# Altium schematic sheet CPU2.schdoc
size C; SheetNumber: 2; SheetTotal: 8
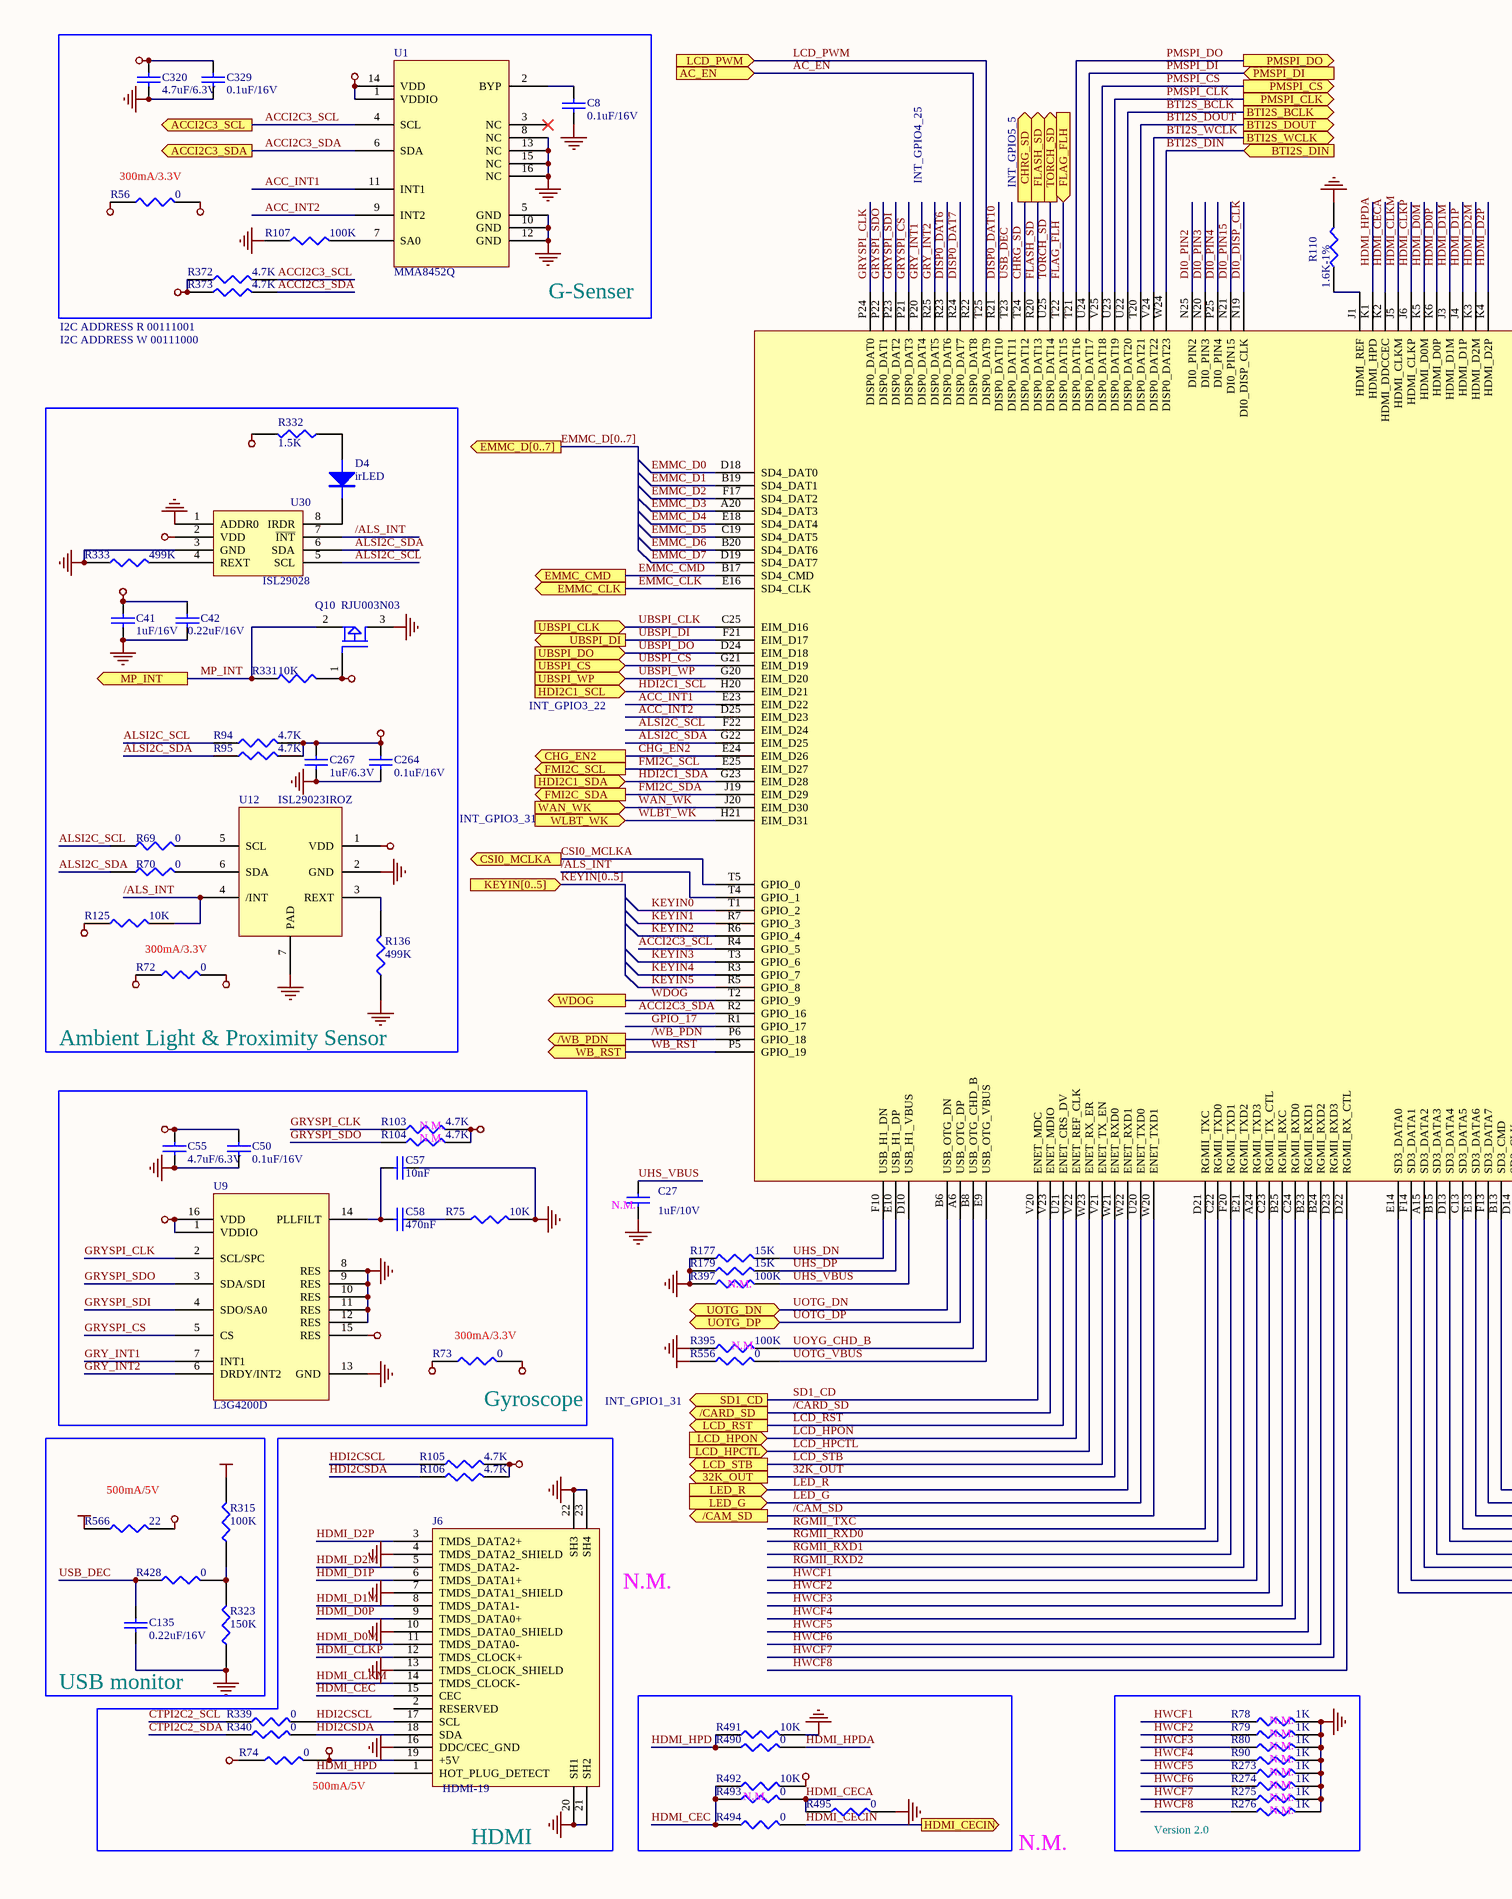
[diagram p0: CPU2.schdoc, left]
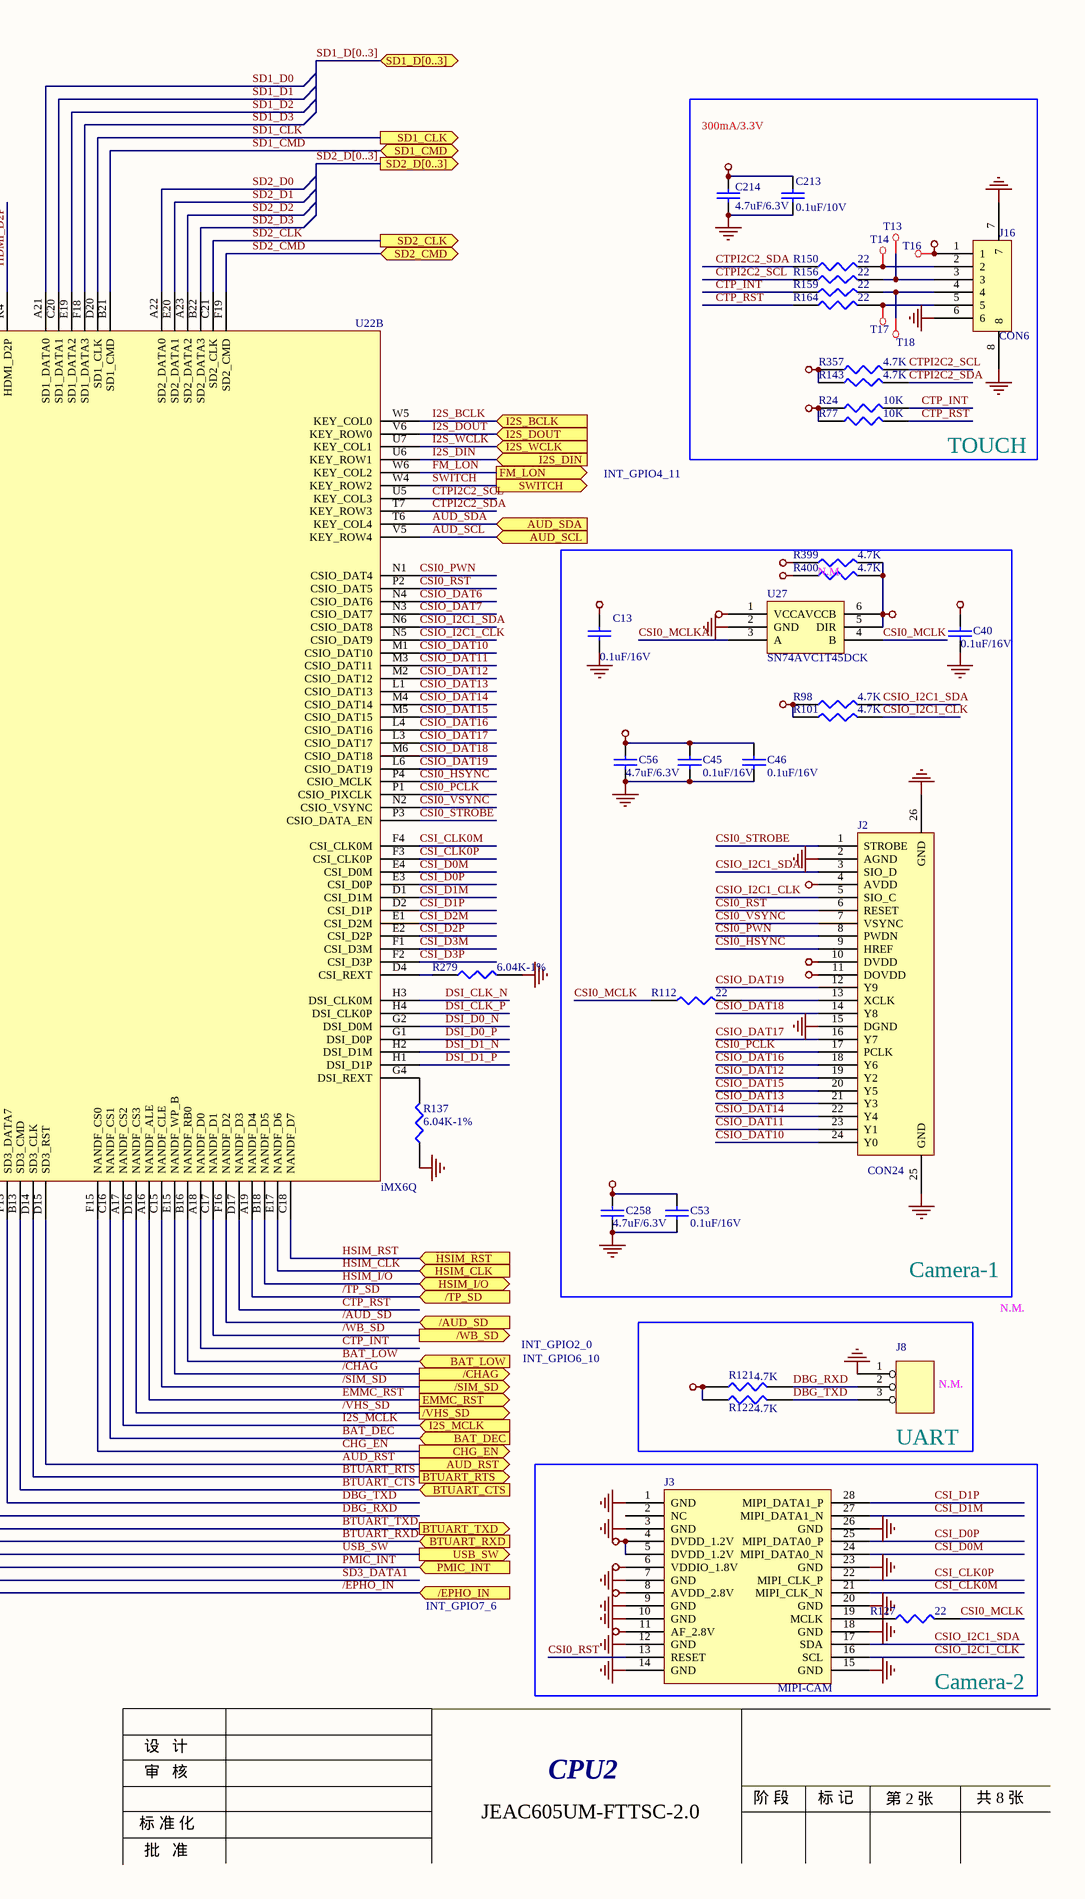
[diagram p1: CPU2.schdoc, right]

## Parts
C8  0.1uF/16V  [C0402]
C13  0.1uF/16V  [C0402]
C27  1uF/10V  [C0603]
C40  0.1uF/16V  [C0402]
C41  1uF/16V  [C0402]
C42  0.22uF/16V  [C0402]
C45  0.1uF/16V  [C0402]
C46  0.1uF/16V  [C0402]
C50  0.1uF/16V  [C0402]
C53  0.1uF/16V  [C0402]
C55  4.7uF/6.3V  [C0603]
C56  4.7uF/6.3V  [C0603]
C57  10nF  [C0402]
C58  470nF  [C0402]
C135  0.22uF/16V  [C0402]
C213  0.1uF/10V  [C0402]
C214  4.7uF/6.3V  [C0603]
C258  4.7uF/6.3V  [C0603]
C264  0.1uF/16V  [C0402]
C267  1uF/6.3V  [C0402]
C320  4.7uF/6.3V  [C0603]
C329  0.1uF/16V  [C0402]
D4  irLED  [R0603]
J2  CON24  [J-CON-24-0_5]
J3  MIPI-CAM  [j-con-GB042-28P-H10-0_4]
J6  HDMI-19  [j-con-19-0_4]
J8  (no value)  [J-CON-3-2_1]
J16  CON6  [J-CON-6-0_5-ATOM]
Q10  RJU003N03  [SOT-23]
R24  10K  [R0402]
R56  0  [R0402]
R69  0  [R0402]
R70  0  [R0402]
R72  0  [R0402]
R73  0  [R0402]
R74  0  [R0603]
R75  10K  [R0402]
R77  10K  [R0402]
R78  1K  [R0402]
R79  1K  [R0402]
R80  1K  [R0402]
R90  1K  [R0402]
R94  4.7K  [R0402]
R95  4.7K  [R0402]
R98  4.7K  [R0402]
R101  4.7K  [R0402]
R103  4.7K  [R0402]
R104  4.7K  [R0402]
R105  4.7K  [R0402]
R106  4.7K  [R0402]
R107  100K  [R0402]
R110  1.6K-1%  [R0402]
R112  22  [R0402]
R121  4.7K  [R0402]
R122  4.7K  [R0402]
R125  10K  [R0402]
R127  22  [R0402]
R136  499K  [R0402]
R137  6.04K-1%  [R0402]
R143  4.7K  [R0402]
R150  22  [R0402]
R156  22  [R0402]
R159  22  [R0402]
R164  22  [R0402]
R177  15K  [R0402]
R179  15K  [R0402]
R273  1K  [R0402]
R274  1K  [R0402]
R275  1K  [R0402]
R276  1K  [R0402]
R279  6.04K-1%  [R0402]
R315  100K  [R0402]
R323  150K  [R0402]
R331  10K  [R0402]
R332  1.5K  [R0402]
R333  499K  [R0402]
R339  0  [R0402]
R340  0  [R0402]
R357  4.7K  [R0402]
R372  4.7K  [R0402]
R373  4.7K  [R0402]
R395  100K  [R0402]
R397  100K  [R0402]
R399  4.7K  [R0402]
R400  4.7K  [R0402]
R428  0  [R0402]
R490  0  [R0402]
R491  10K  [R0402]
R492  10K  [R0402]
R493  0  [R0402]
R494  0  [R0402]
R495  0  [R0402]
R556  0  [R0402]
R566  22  [R0402]
T13  Testpoint  [TP2_0]  (value not drawn)
T14  Testpoint  [TP2_0]  (value not drawn)
T16  Testpoint  [TP2_0]  (value not drawn)
T17  Testpoint  [TP2_0]  (value not drawn)
T18  Testpoint  [TP2_0]  (value not drawn)
U1  MMA8452Q  [U-DFN-16-0_5]
U9  L3G4200D  [U-LGA-16-0_65]
U12  ISL29023IROZ  [U-ODFN-6-0_65]
U22  iMX6Q  [U-BGA-624-0_8]  (part B of 3)
U27  SN74AVC1T45DCK  [SOT-363-6-0_65]
U30  ISL29028  [U-ODFN-8-0_5]

## Blocks framed on the sheet
G-Senser: C8 C320 C329 R56 R107 R372 R373 U1
TOUCH: C213 C214 J16 R24 R77 R143 R150 R156 R159 R164 R357 T13 T14 T16-T18
Ambient Light & Proximity Sensor: C41 C42 C264 C267 D4 Q10 R69 R70 R72 R94 R95 R125 R136 R331-R333 U12 U30
Camera-1: C13 C40 C45 C46 C53 C56 C258 J2 R98 R101 R112 R399 R400 U27
Gyroscope: C50 C55 C57 C58 R73 R75 R103 R104 U9
UART: J8 R121 R122
USB monitor: C135 R315 R323 R428 R566
HDMI: J6 R74 R105 R106 R339 R340
Camera-2: J3 R127
N.M.: R490-R495

## Ports
32K_OUT (out), /AUD_SD (in), /CAM_SD (out), /CARD_SD (out), /CHAG (out), /EPHO_IN (in), /SIM_SD (out), /TP_SD (in), /VHS_SD (out), /WB_PDN (out), /WB_SD (out), AC_EN (in), ACCI2C3_SCL (out), ACCI2C3_SDA (out), AUD_RST (out), AUD_SCL (in), AUD_SDA (in), BAT_DEC (in), BAT_LOW (in), BTI2S_BCLK (out), BTI2S_DIN (in), BTI2S_DOUT (out), BTI2S_WCLK (out), BTUART_CTS (in), BTUART_RTS (out), BTUART_RXD (in), BTUART_TXD (out), CHG_EN2 (out), CHG_EN (out), CHRG_SD (out), CSI0_MCLKA (out), EMMC_CLK (out), EMMC_CMD (out), EMMC_D[0..7] (out), EMMC_RST (out), FLAG_FLH (in), FLASH_SD (out), FM_LON (out), FMI2C_SCL (out), FMI2C_SDA (out), HDI2C1_SCL (in), HDI2C1_SDA (in), HDMI_CECIN (out), HSIM_CLK (in), HSIM_I/O (bidir), HSIM_RST (in), I2S_BCLK (in), I2S_DIN (in), I2S_DOUT (in), I2S_MCLK (in), I2S_WCLK (in), KEYIN[0..5] (in), LCD_HPCTL (in), LCD_HPON (in), LCD_PWM (in), LCD_RST (out), LCD_STB (out), LED_G (in), LED_R (in), MP_INT (out), PMIC_INT (in), PMSPI_CLK (out), PMSPI_CS (out), PMSPI_DI (in), PMSPI_DO (out), SD1_CD (out), SD1_CLK (out), SD1_CMD (bidir), SD1_D[0..3] (bidir), SD2_CLK (out), SD2_CMD (bidir), SD2_D[0..3] (out), SWITCH (out), TORCH_SD (out), UBSPI_CLK (in), UBSPI_CS (in), UBSPI_DI (out), UBSPI_DO (in), UBSPI_WP (in), UOTG_DN (bidir), UOTG_DP (bidir), USB_SW (out), WAN_WK (in), WB_RST (out), WDOG (out), WLBT_WK (in)

## Nets
GND: C8.1 C13.2 C27.2 C40.2 C41.2 C42.2 C45.2 C46.2 C50.1 C53.2 C55.1 C56.1 C57.1 C135.2 C213.2 C214.2 C258.1 C264.1 C267.1 C320.1 C329.1 J2.2(AGND) J2.15(DGND) J2.25(GND) J2.26(GND) J3.1(GND) J3.3(GND) J3.7(GND) J3.9(GND) J3.10(GND) J3.12(GND) J3.14(GND) J3.15(GND) J3.18(GND) J3.20(GND) J3.23(GND) J3.26(GND) J6.4(TMDS_DATA2_SHIELD) J6.7(TMDS_DATA1_SHIELD) J6.10(TMDS_DATA0_SHIELD) J6.13(TMDS_CLOCK_SHIELD) J6.16(DDC/CEC_GND) J6.20(SH1) J6.21(SH2) J6.22(SH3) J6.23(SH4) J8.1 J16.6 J16.7 J16.8 Q10.3(D) R75.2 R78.2 R79.2 R80.2 R90.2 R107.1 R110.2 R136.1 R137.1 R177.1 R179.1 R273.2 R274.2 R275.2 R276.2 R279.2 R323.1 R333.1 R395.1 R397.1 R491.2 R495.2 U1.5(GND) U1.8(NC) U1.10(GND) U1.12(GND) U1.13(NC) U1.15(NC) U1.16(NC) U9.8(RES) U9.9(RES) U9.10(RES) U9.11(RES) U9.12(RES) U9.13(GND) U12.2(GND) U12.7(PAD) U27.2(GND) U30.1(ADDR0) U30.3(GND)
USB_BUSIN: R315.2 R556.1 R566.1
VBUS: R74.1 R566.2
VCC_3V: C13.1 R121.1 R122.1 U27.1(VCCA)
VCC_ACC: C320.2 C329.2 R56.2 R372.1 R373.1 U1.1(VDDIO) U1.14(VDD)
VCC_ALS: C41.1 C42.1 C264.2 C267.2 Q10.1(G) R72.2 R94.2 R95.2 R125.1 R331.2 R332.2 U12.1(VDD) U30.2(VDD)
VCC_CAM: C45.1 C46.1 C56.2 J2.4(AVDD) J2.11(DOVDD) J3.6(VDDIO_1.8V) J3.8(AVDD_2.8V) J3.11(AF_2.8V) R98.1 R101.1
VCC_CAMD: C53.1 C258.2 J2.10(DVDD) J3.4(DVDD_1.2V) J3.5(DVDD_1.2V)
VCC_CSI: R399.1
VCC_GYR: C50.2 C55.2 R73.2 R103.2 R104.2 U9.1(VDDIO) U9.15(RES) U9.16(VDD)
VCC_HD: J6.19(+5V) R74.2 R105.2 R106.2 R492.2
VCC_MCLK: C40.1 R399.2 R400.2 U27.5(DIR) U27.6(VCCB)
VCC_MEMS: R56.1 R72.1 R73.1
VCC_MIPI: R400.1
VCC_TOUCH: C213.1 C214.1 J16.1 R24.1 R77.1 R143.1 R357.1 T16.1(TP)
32K_OUT: U22.W21(ENET_RXD0) ; port 32K_OUT
/ALS_INT: R125.2 U12.4(/INT) U22.T4(GPIO_1) U30.7(~{INT})
/AUD_SD: U22.F16(NANDF_D2) ; port /AUD_SD
/CAM_SD: U22.W20(ENET_TXD1) ; port /CAM_SD
/CARD_SD: U22.V23(ENET_MDIO) ; port /CARD_SD
/CHAG: U22.E15(NANDF_WP_B) ; port /CHAG
/EPHO_IN: U22.E14(SD3_DATA0) ; port /EPHO_IN
/SIM_SD: U22.C15(NANDF_CLE) ; port /SIM_SD
/TP_SD: U22.A19(NANDF_D4) ; port /TP_SD
/VHS_SD: U22.D16(NANDF_CS3) ; port /VHS_SD
/WB_PDN: U22.P6(GPIO_18) ; port /WB_PDN
/WB_SD: U22.C17(NANDF_D1) ; port /WB_SD
AC_EN: U22.R22(DISP0_DAT8) ; port AC_EN
ACC_INT1: U1.11(INT1) U22.E23(EIM_D22)
ACC_INT2: U1.9(INT2) U22.D25(EIM_D23)
ACCI2C3_SCL: R372.2 U1.4(SCL) U22.R4(GPIO_5) ; port ACCI2C3_SCL
ACCI2C3_SDA: R373.2 U1.6(SDA) U22.R2(GPIO_16) ; port ACCI2C3_SDA
ALSI2C_SCL: R69.1 R94.1 U22.F22(EIM_D24) U30.5(SCL)
ALSI2C_SDA: R70.1 R95.1 U22.G22(EIM_D25) U30.6(SDA)
AUD_RST: U22.D15(SD3_RST) ; port AUD_RST
AUD_SCL: U22.V5(KEY_ROW4) ; port AUD_SCL
AUD_SDA: U22.T6(KEY_COL4) ; port AUD_SDA
BAT_DEC: U22.C16(NANDF_CS1) ; port BAT_DEC
BAT_LOW: U22.B16(NANDF_RB0) ; port BAT_LOW
BTI2S_BCLK: U22.U22(DISP0_DAT20) ; port BTI2S_BCLK
BTI2S_DIN: U22.W24(DISP0_DAT23) ; port BTI2S_DIN
BTI2S_DOUT: U22.T20(DISP0_DAT21) ; port BTI2S_DOUT
BTI2S_WCLK: U22.V24(DISP0_DAT22) ; port BTI2S_WCLK
BTUART_CTS: U22.B13(SD3_CMD) ; port BTUART_CTS
BTUART_RTS: U22.D14(SD3_CLK) ; port BTUART_RTS
BTUART_RXD: U22.D13(SD3_DATA4) ; port BTUART_RXD
BTUART_TXD: U22.C13(SD3_DATA5) ; port BTUART_TXD
CHG_EN: U22.F15(NANDF_CS0) ; port CHG_EN
CHG_EN2: U22.E24(EIM_D26) ; port CHG_EN2
CHRG_SD: U22.T24(DISP0_DAT12) ; port CHRG_SD
CSI0_HSYNC: J2.9(HREF) U22.P4(CSIO_MCLK)
CSI0_MCLK: R112.1 R127.2 U27.4(B)
CSI0_MCLKA: U22.T5(GPIO_0) U27.3(A) ; port CSI0_MCLKA
CSI0_PCLK: J2.17(PCLK) U22.P1(CSIO_PIXCLK)
CSI0_PWN: J2.8(PWDN) U22.N1(CSIO_DAT4)
CSI0_RST: J2.6(RESET) J3.13(RESET) U22.P2(CSIO_DAT5)
CSI0_STROBE: J2.1(STROBE) U22.P3(CSIO_DATA_EN)
CSI0_VSYNC: J2.7(VSYNC) U22.N2(CSIO_VSYNC)
CSI_CLK0M: J3.21(MIPI_CLK_N) U22.F4(CSI_CLK0M)
CSI_CLK0P: J3.22(MIPI_CLK_P) U22.F3(CSI_CLK0P)
CSI_D0M: J3.24(MIPI_DATA0_N) U22.E4(CSI_D0M)
CSI_D0P: J3.25(MIPI_DATA0_P) U22.E3(CSI_D0P)
CSI_D1M: J3.27(MIPI_DATA1_N) U22.D1(CSI_D1M)
CSI_D1P: J3.28(MIPI_DATA1_P) U22.D2(CSI_D1P)
CSI_D2M: U22.E1(CSI_D2M)
CSI_D2P: U22.E2(CSI_D2P)
CSI_D3M: U22.F1(CSI_D3M)
CSI_D3P: U22.F2(CSI_D3P)
CSIO_DAT6: U22.N4(CSIO_DAT6)
CSIO_DAT7: U22.N3(CSIO_DAT7)
CSIO_DAT10: J2.24(Y0) U22.M1(CSIO_DAT10)
CSIO_DAT11: J2.23(Y1) U22.M3(CSIO_DAT11)
CSIO_DAT12: J2.19(Y2) U22.M2(CSIO_DAT12)
CSIO_DAT13: J2.21(Y3) U22.L1(CSIO_DAT13)
CSIO_DAT14: J2.22(Y4) U22.M4(CSIO_DAT14)
CSIO_DAT15: J2.20(Y5) U22.M5(CSIO_DAT15)
CSIO_DAT16: J2.18(Y6) U22.L4(CSIO_DAT16)
CSIO_DAT17: J2.16(Y7) U22.L3(CSIO_DAT17)
CSIO_DAT18: J2.14(Y8) U22.M6(CSIO_DAT18)
CSIO_DAT19: J2.12(Y9) U22.L6(CSIO_DAT19)
CSIO_I2C1_CLK: J2.5(SIO_C) J3.16(SCL) R101.2 U22.N5(CSIO_DAT9)
CSIO_I2C1_SDA: J2.3(SIO_D) J3.17(SDA) R98.2 U22.N6(CSIO_DAT8)
CTP_INT: R24.2 R159.1 U22.A18(NANDF_D0)
CTP_RST: R77.2 R164.1 U22.D17(NANDF_D3)
CTPI2C2_SCL: R156.1 R339.1 R357.2 U22.U5(KEY_COL3)
CTPI2C2_SDA: R143.2 R150.1 R340.1 U22.T7(KEY_ROW3)
DBG_RXD: J8.2 R121.2 U22.E13(SD3_DATA6)
DBG_TXD: J8.3 R122.2 U22.F13(SD3_DATA7)
DI0_DISP_CLK: U22.N19(DI0_DISP_CLK)
DI0_PIN2: U22.N25(DI0_PIN2)
DI0_PIN3: U22.N20(DI0_PIN3)
DI0_PIN4: U22.P25(DI0_PIN4)
DI0_PIN15: U22.N21(DI0_PIN15)
DISP0_DAT6: U22.R23(DISP0_DAT6)
DISP0_DAT7: U22.R24(DISP0_DAT7)
DISP0_DAT10: U22.R21(DISP0_DAT10)
DSI_CLK_N: U22.H3(DSI_CLK0M)
DSI_CLK_P: U22.H4(DSI_CLK0P)
DSI_D0_N: U22.G2(DSI_D0M)
DSI_D0_P: U22.G1(DSI_D0P)
DSI_D1_N: U22.H2(DSI_D1M)
DSI_D1_P: U22.H1(DSI_D1P)
EMMC_CLK: U22.E16(SD4_CLK) ; port EMMC_CLK
EMMC_CMD: U22.B17(SD4_CMD) ; port EMMC_CMD
EMMC_D0: U22.D18(SD4_DAT0)
EMMC_D1: U22.B19(SD4_DAT1)
EMMC_D2: U22.F17(SD4_DAT2)
EMMC_D3: U22.A20(SD4_DAT3)
EMMC_D4: U22.E18(SD4_DAT4)
EMMC_D5: U22.C19(SD4_DAT5)
EMMC_D6: U22.B20(SD4_DAT6)
EMMC_D7: U22.D19(SD4_DAT7)
EMMC_RST: U22.A16(NANDF_ALE) ; port EMMC_RST
FLAG_FLH: U22.T22(DISP0_DAT15) ; port FLAG_FLH
FLASH_SD: U22.R20(DISP0_DAT13) ; port FLASH_SD
FM_LON: U22.W6(KEY_COL2) ; port FM_LON
FMI2C_SCL: U22.E25(EIM_D27) ; port FMI2C_SCL
FMI2C_SDA: U22.J19(EIM_D29) ; port FMI2C_SDA
GPIO_17: U22.R1(GPIO_17)
GRY_INT1: U9.7(INT1) U22.P20(DISP0_DAT4)
GRY_INT2: U9.6(DRDY/INT2) U22.R25(DISP0_DAT5)
GRYSPI_CLK: R103.1 U9.2(SCL/SPC) U22.P24(DISP0_DAT0)
GRYSPI_CS: U9.5(CS) U22.P21(DISP0_DAT3)
GRYSPI_SDI: U9.4(SDO/SA0) U22.P23(DISP0_DAT2)
GRYSPI_SDO: R104.1 U9.3(SDA/SDI) U22.P22(DISP0_DAT1)
HDI2C1_SCL: U22.H20(EIM_D21) ; port HDI2C1_SCL
HDI2C1_SDA: U22.G23(EIM_D28) ; port HDI2C1_SDA
HDI2CSCL: J6.17(SCL) R105.1 R339.2
HDI2CSDA: J6.18(SDA) R106.1 R340.2
HDMI_CEC: J6.15(CEC) R492.1 R493.1 R494.1
HDMI_CECA: R493.2 R495.1 U22.K2(HDMI_DDCCEC)
HDMI_CECIN: R494.2 ; port HDMI_CECIN
HDMI_CLKM: J6.14(TMDS_CLOCK-) U22.J5(HDMI_CLKM)
HDMI_CLKP: J6.12(TMDS_CLOCK+) U22.J6(HDMI_CLKP)
HDMI_D0M: J6.11(TMDS_DATA0-) U22.K5(HDMI_D0M)
HDMI_D0P: J6.9(TMDS_DATA0+) U22.K6(HDMI_D0P)
HDMI_D1M: J6.8(TMDS_DATA1-) U22.J3(HDMI_D1M)
HDMI_D1P: J6.6(TMDS_DATA1+) U22.J4(HDMI_D1P)
HDMI_D2M: J6.5(TMDS_DATA2-) U22.K3(HDMI_D2M)
HDMI_D2P: J6.3(TMDS_DATA2+) U22.K4(HDMI_D2P)
HDMI_HPD: J6.1(HOT_PLUG_DETECT) R490.1 R491.1
HDMI_HPDA: R490.2 U22.K1(HDMI_HPD)
HSIM_CLK: U22.E17(NANDF_D6) ; port HSIM_CLK
HSIM_I/O: U22.B18(NANDF_D5) ; port HSIM_I/O
HSIM_RST: U22.C18(NANDF_D7) ; port HSIM_RST
HWCF1: R78.1 U22.A24(RGMII_TXD3)
HWCF2: R79.1 U22.C23(RGMII_TX_CTL)
HWCF3: R80.1 U22.B25(RGMII_RXC)
HWCF4: R90.1 U22.C24(RGMII_RXD0)
HWCF5: R273.1 U22.B23(RGMII_RXD1)
HWCF6: R274.1 U22.B24(RGMII_RXD2)
HWCF7: R275.1 U22.D23(RGMII_RXD3)
HWCF8: R276.1 U22.D22(RGMII_RX_CTL)
I2S_BCLK: U22.W5(KEY_COL0) ; port I2S_BCLK
I2S_DIN: U22.U6(KEY_ROW1) ; port I2S_DIN
I2S_DOUT: U22.V6(KEY_ROW0) ; port I2S_DOUT
I2S_MCLK: U22.A17(NANDF_CS2) ; port I2S_MCLK
I2S_WCLK: U22.U7(KEY_COL1) ; port I2S_WCLK
KEYIN0: U22.T1(GPIO_2)
KEYIN1: U22.R7(GPIO_3)
KEYIN2: U22.R6(GPIO_4)
KEYIN3: U22.T3(GPIO_6)
KEYIN4: U22.R3(GPIO_7)
KEYIN5: U22.R5(GPIO_8)
LCD_HPCTL: U22.W23(ENET_RX_ER) ; port LCD_HPCTL
LCD_HPON: U22.V22(ENET_REF_CLK) ; port LCD_HPON
LCD_PWM: U22.T25(DISP0_DAT9) ; port LCD_PWM
LCD_RST: U22.U21(ENET_CRS_DV) ; port LCD_RST
LCD_STB: U22.V21(ENET_TX_EN) ; port LCD_STB
LED_G: U22.U20(ENET_TXD0) ; port LED_G
LED_R: U22.W22(ENET_RXD1) ; port LED_R
MP_INT: Q10.2(S) R331.1 ; port MP_INT
PMIC_INT: U22.A15(SD3_DATA2) ; port PMIC_INT
PMSPI_CLK: U22.U23(DISP0_DAT19) ; port PMSPI_CLK
PMSPI_CS: U22.V25(DISP0_DAT18) ; port PMSPI_CS
PMSPI_DI: U22.U24(DISP0_DAT17) ; port PMSPI_DI
PMSPI_DO: U22.T21(DISP0_DAT16) ; port PMSPI_DO
RGMII_RXD0: U22.C22(RGMII_TXD0)
RGMII_RXD1: U22.F20(RGMII_TXD1)
RGMII_RXD2: U22.E21(RGMII_TXD2)
RGMII_TXC: U22.D21(RGMII_TXC)
SD1_CD: U22.V20(ENET_MDC) ; port SD1_CD
SD1_CLK: U22.D20(SD1_CLK) ; port SD1_CLK
SD1_CMD: U22.B21(SD1_CMD) ; port SD1_CMD
SD1_D0: U22.A21(SD1_DATA0)
SD1_D1: U22.C20(SD1_DATA1)
SD1_D2: U22.E19(SD1_DATA2)
SD1_D3: U22.F18(SD1_DATA3)
SD2_CLK: U22.C21(SD2_CLK) ; port SD2_CLK
SD2_CMD: U22.F19(SD2_CMD) ; port SD2_CMD
SD2_D0: U22.A22(SD2_DATA0)
SD2_D1: U22.E20(SD2_DATA1)
SD2_D2: U22.A23(SD2_DATA2)
SD2_D3: U22.B22(SD2_DATA3)
SD3_DATA1: U22.F14(SD3_DATA1)
SWITCH: U22.W4(KEY_ROW2) ; port SWITCH
TORCH_SD: U22.U25(DISP0_DAT14) ; port TORCH_SD
UBSPI_CLK: U22.C25(EIM_D16) ; port UBSPI_CLK
UBSPI_CS: U22.G21(EIM_D19) ; port UBSPI_CS
UBSPI_DI: U22.F21(EIM_D17) ; port UBSPI_DI
UBSPI_DO: U22.D24(EIM_D18) ; port UBSPI_DO
UBSPI_WP: U22.G20(EIM_D20) ; port UBSPI_WP
UHS_DN: R177.2 U22.F10(USB_H1_DN)
UHS_DP: R179.2 U22.E10(USB_H1_DP)
UHS_VBUS: C27.1 R397.2 U22.D10(USB_H1_VBUS)
UOTG_DN: U22.B6(USB_OTG_DN) ; port UOTG_DN
UOTG_DP: U22.A6(USB_OTG_DP) ; port UOTG_DP
UOTG_VBUS: R556.2 U22.E9(USB_OTG_VBUS)
UOYG_CHD_B: R395.2 U22.B8(USB_OTG_CHD_B)
USB_DEC: C135.1 R428.1 U22.T23(DISP0_DAT11)
USB_SW: U22.B15(SD3_DATA3) ; port USB_SW
WAN_WK: U22.J20(EIM_D30) ; port WAN_WK
WB_RST: U22.P5(GPIO_19) ; port WB_RST
WDOG: U22.T2(GPIO_9) ; port WDOG
WLBT_WK: U22.H21(EIM_D31) ; port WLBT_WK
NetC8_2: C8.2 U1.2(BYP)
NetC57_2: C57.2 C58.2 U9.14(PLLFILT)
NetC58_1: C58.1 R75.1
NetD4_1: D4.1 R332.1
NetD4_2: D4.2 U30.8(IRDR)
NetJ2_13: J2.13(XCLK) R112.2
NetJ3_19: J3.19(MCLK) R127.1
NetJ16_2: J16.2 R150.2 T14.1(TP)
NetJ16_3: J16.3 R156.2 T13.1(TP)
NetJ16_4: J16.4 R159.2 T18.1(TP)
NetJ16_5: J16.5 R164.2 T17.1(TP)
NetR69_2: R69.2 U12.5(SCL)
NetR70_2: R70.2 U12.6(SDA)
NetR107_2: R107.2 U1.7(SA0)
NetR110_1: R110.1 U22.J1(HDMI_REF)
NetR136_2: R136.2 U12.3(REXT)
NetR137_2: R137.2 U22.G4(DSI_REXT)
NetR279_1: R279.1 U22.D4(CSI_REXT)
NetR315_1: R315.1 R323.2 R428.2
NetR333_2: R333.2 U30.4(REXT)

Not connected (* = marked no-connect by the designer): J3 2(NC); J6 2(RESERVED); U1 3(NC)*

## Buses and harness runs
bus EMMC_D[0..7] = port EMMC_D[0..7]
bus KEYIN[0..5] = port KEYIN[0..5]
bus SD1_D[0..3] = port SD1_D[0..3]
bus SD2_D[0..3] = port SD2_D[0..3]

## Notes on the sheet
- (near R56) 300mA/3.3V
- INT_GPIO4_25
- INT_GPIO5_5
- 300mA/3.3V
- I2C ADDRESS R 00111001
- I2C ADDRESS W 00111000
- INT_GPIO4_11
- N.M.
- INT_GPIO3_22
- INT_GPIO3_31
- (near R103) N.M.
- (near C27) N.M.
- (near R73) 300mA/3.3V
- (near R397) N.M.
- (near R395) N.M.
- INT_GPIO2_0
- INT_GPIO1_31
- INT_GPIO6_10
- (near J8) N.M.
- (near R566) 500mA/5V
- (near J6) N.M.
- INT_GPIO7_6
- (near R78) N.M.
- (near R74) 500mA/5V
- (near R90) N.M.
- (near R80) N.M.
- (near R79) N.M.
- (near R275) N.M.
- (near R274) N.M.
- (near R273) N.M.
- 设   计
- 审   核
- CPU2
- Version 2.0
- (near R276) N.M.
- 标 准 化
- 批   准
- JEAC605UM-FTTSC-2.0
- 阶 段
- 标 记
- 第 2 张
- 共 8 张

## Library data of the parts
C8 C50 C55 C57 C58 C264 C267 C320 C329 = CAP
C13 C27 C40-C42 C45 C46 C53 C56 C135 C213 C214 C258 = CAP: Capacitor
D4 = DIODE
J2 = CON-24
J3 = MIPI-28
J8 = 3 HEADER
Q10 = SI1021
R24 R56 R69 R70 R72-R75 R77-R80 R90 R94 R95 R98 R101 R103-R107 R110 R112 R121 R122 R125 R127 R136 R137 R143 R150 R156 R159 R164 R177 R179 R273-R276 R279 R315 R323 R331-R333 R339 R340 R357 R372 R373 R395 R397 R399 R400 R428 R490-R495 R556 R566 = RES1
U22 = IMX6Q: pin to pad: A4>132 A5>U12 A8>133 A12>A10 A13>130 A14>A12 A15>F17 A16>83 A17>85 A19>91 A25>131 AA7>139 AA16>136 AA22>138 AA23>72 AA24>Y23 AA25>Y22 AB3>141 AB24>140 AB25>67 AC24>62 AC25>66 AD1>G23 AD2>H20 AD3>H22 AD4>147 AD5>E21 AD6>D23 AD7>148 AD8>T22 AD9>V23 AD10>142 AD11>AA22 AD12>L20 AD13>143 AD14>P22 AD15>K23 AD16>144 AD17>P19 AD18>H23 AD19>145 AD20>D23 AD21>54 AD22>146 AD23>T22 AD24>77 AD25>65 AE1>149 AE2>G21 AE3>H23 AE4>G22 AE5>D21 AE6>D22 AE7>D20 AE8>T23 AE9>Y20 AE10>W20 AE11>Y21 AE12>M21 AE13>N21 AE14>P23 AE15>K22 AE16>L18 AE17>M23 AE18>H22 AE19>46 AE20>D22 AE21>57 AE22>60 AE23>T23 AE24>61 AE25>150 B4>151 B5>170 B12>B10 B14>B12 B15>F16 B16>86 C1>152 C2>E15 C3>A8 C4>154 C6>155 C8>F9 C10>153 C13>C20 C15>84 C16>84 C17>88 C18>94 C25>U6 D3>156 D6>157 D8>158 D13>A21 D14>E16 D16>86 D17>90 D24>V1 D25>Y1 E5>159 E6>160 E7>161 E8>215 E13>E19 E14>A20 E15>85 E17>93 E20>C14 E22>Y3 E23>W2 E24>V5 E25>V4 F5>162 F6>163 F7>164 F15>83 F16>89 F23>Y4 F24>AA3 F25>Y5 G3>168 G5>C16 G6>W23 G10>166 G11>279 G14>H14 G15>209 G17>237 G19>167 G20>W1 G21>V2 G22>W3 G23>AA1 G24>V7 G25>W7 H5>73 H6>70 H8>172 H9>277 H10>296 H11>259 H12>169 H13>244 H16>267 H17>287 H18>171 H19>W6 H20>V3 H21>W5 H22>P18 H23>AA4 H24>W8 H25>G20 J4>D14 J5>F18 J7>298 J8>177 J9>278 J10>297 J11>260 J12>173 J13>245 J14>238 J15>174 J16>268 J17>288 J18>175 J19>AA2 J21>V6 J22>AB3 J23>Y7 J24>V8 J25>J21 K7>D13 K8>182 K9>251 K10>178 K11>261 K12>179 K13>246 K14>239 K15>180 K16>269 K17>289 K18>181 K19>258 K20>AB4 K22>AA6 K23>AB5 K24>W9 K25>R21 L7>M7 L8>189 L9>252 L10>183 L11>262 L13>247 L14>240 L15>185 L16>270 L17>290 L18>186 L19>U9 L20>R22 L21>AA7 L22>F23 L23>V9 L24>T21 L25>C23 M8>194 M9>253 M10>190 M11>263 M12>191 M13>248 M14>241 M15>192 M16>271 M17>291 M18>193 M19>U9 M20>E20 M21>W10 M22>U20 M23>C22 M24>V10 M25>AB9 N7>B19 N8>198 N9>254 N10>195 N11>264 N12>294 N13>249 N14>242 N15>196 N16>272 N17>292 N18>197 N19>R2 N20>C2 N21>E4 N22>W11 N23>W21 N24>R23 N25>D3 P7>165 P8>203 P9>255 P10>199 P11>265 P12>200 P13>250 P14>243 P15>201 P16>273 P17>293 P18>202 P19>J7 P20>R6 P22>J4 P23>N4 P24>J5 P25>D2 R1>A3 R2>C6 R3>A4 R4>A5 R5>B5 R6>D8 R8>207 R9>256 R10>280 R11>266 R12>204 R13>250 R14>243 R15>205 R16>274 R17>206 R18>28 R19>E7 R21>G3 R22>G6 R23>R3 R24>H6 R25>R1 T1>B21 T2>E8 T3>A19 T4>W22 T5>C8 T6>E5 T8>213 T9>257 T10>281 T11>208 T13>282 T14>283 T15>210 T16>275 T17>211 T18>29 T19>212 T20>C1 T21>D1 T22>F3 T23>H5 T24>N3 T25>E2 U5>F6 U6>D6 U8>218 U10>284 U13>285 U14>286 U15>216 U18>30 U19>219 U20>D17 U21>K20 U22>F4 U23>G5 U24>F5 U25>F2 V5>E6 V6>B3 V8>220 V9>40 V10>31 V11>32 V12>33 V13>34 V14>35 V15>36 V16>37 V17>38 V18>39 V19>221 V23>A21 V24>E3 V25>U1 W3>222 W4>D18 W5>B21 W6>C4 W7>223 W8>224 W9>225 W10>226 W11>227 W15>230 W16>231 W17>232 W18>233 W19>234 W20>B17 W21>D15 W22>C19 W23>F12 W24>C3 W25>74 Y5>235 Y20>55 Y21>78 Y24>236 Y25>69
U27 = Component_1